# Altium schematic sheet Sheet2.SchDoc
size A4; SheetNumber: 2; SheetTotal: 3
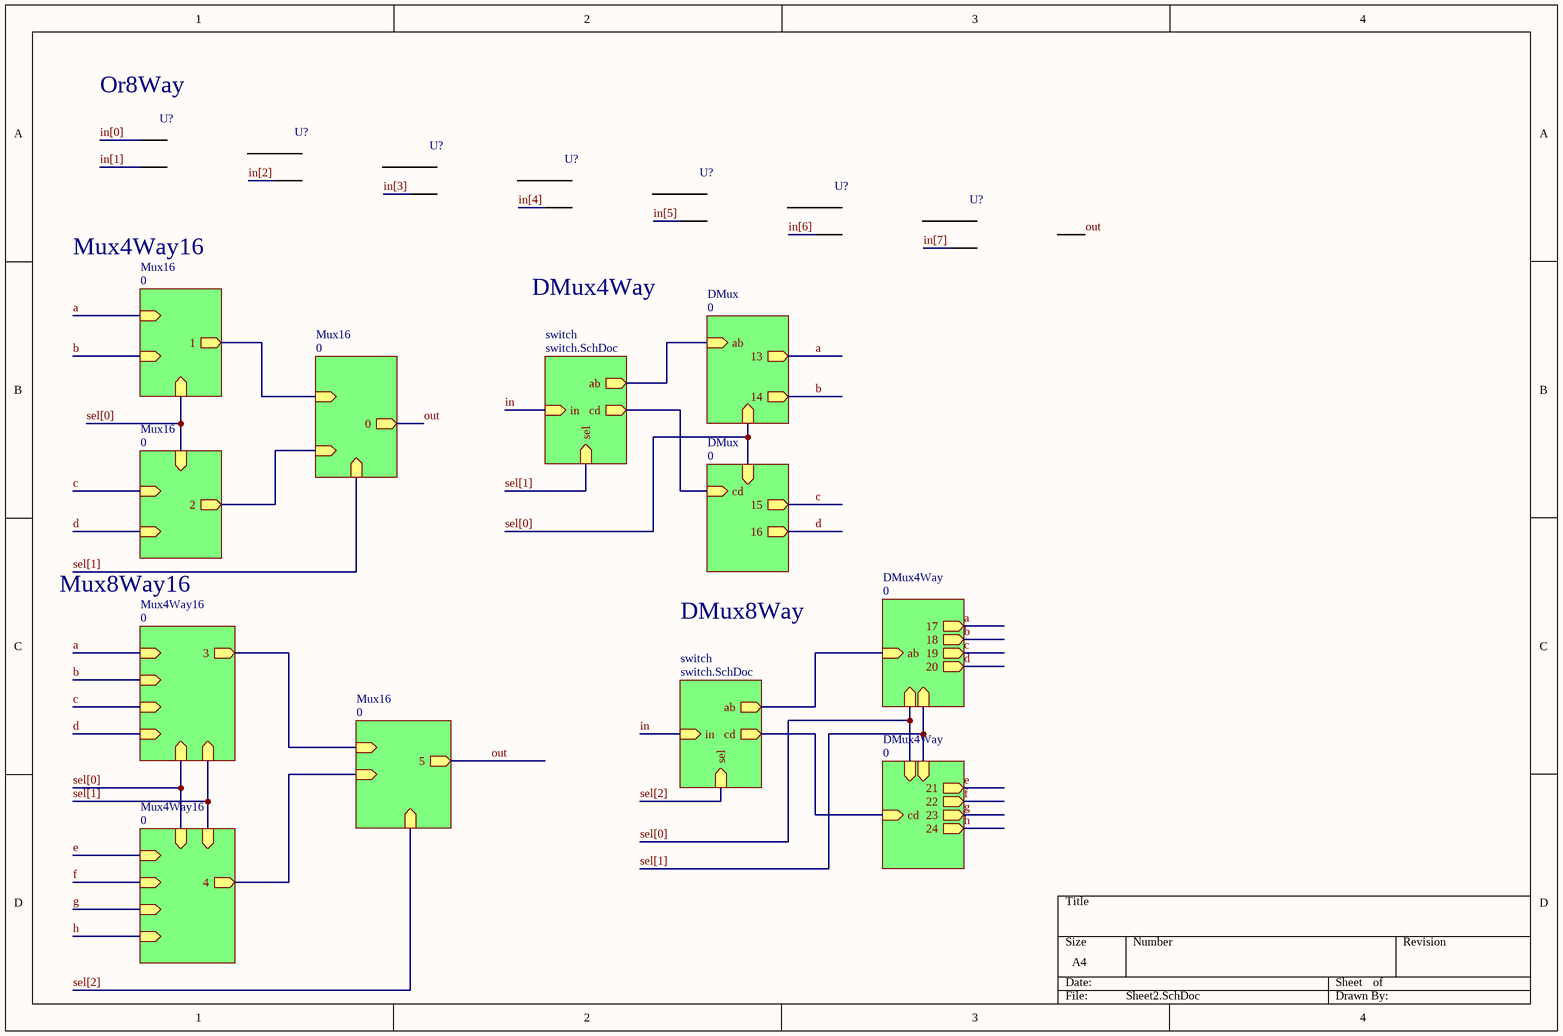
[diagram p0: Sheet2.SchDoc]

## Parts
(Parts that share a designator on the sheet are numbered #1, #2 ... from top to bottom, then left to right.)
U?#1  Digital OR Gate  (value not drawn)
U?#2  Digital OR Gate  (value not drawn)
U?#3  Digital OR Gate  (value not drawn)
U?#4  Digital OR Gate  (value not drawn)
U?#5  Digital OR Gate  (value not drawn)
U?#6  Digital OR Gate  (value not drawn)
U?#7  Digital OR Gate  (value not drawn)

## Sub-sheets
DMux = 0: ab (in),  (in), 13 (out), 14 (out)
DMux = 0: cd (in),  (in), 15 (out), 16 (out)
DMux4Way = 0: ab (in),  (in),  (in), 17 (out), 18 (out), 19 (out), 20 (out)
DMux4Way = 0: cd (in),  (in),  (in), 21 (out), 22 (out), 23 (out), 24 (out)
Mux4Way16 = 0:  (in),  (in),  (in),  (in),  (in),  (in), 3 (out)
Mux4Way16 = 0:  (in),  (in),  (in),  (in),  (in),  (in), 4 (out)
Mux16 = 0:  (in),  (in),  (in), 1 (out)
Mux16 = 0:  (in),  (in),  (in), 2 (out)
Mux16 = 0:  (in),  (in),  (in), 0 (out)
Mux16 = 0:  (in),  (in),  (in), 5 (out)
switch = switch.SchDoc: in (in), sel (in), ab (out), cd (out)
switch = switch.SchDoc: in (in), sel (in), ab (out), cd (out)

## Nets
a: sheet Mux16/, sheet Mux4Way16/, sheet DMux/13, sheet DMux4Way/17
b: sheet Mux16/, sheet Mux4Way16/, sheet DMux/14, sheet DMux4Way/18
c: sheet Mux16/, sheet Mux4Way16/, sheet DMux/15, sheet DMux4Way/19
d: sheet Mux16/, sheet Mux4Way16/, sheet DMux/16, sheet DMux4Way/20
e: sheet Mux4Way16/, sheet DMux4Way/21
f: sheet Mux4Way16/, sheet DMux4Way/22
g: sheet Mux4Way16/, sheet DMux4Way/23
h: sheet Mux4Way16/, sheet DMux4Way/24
in: sheet switch/in, sheet switch/in
in[0]: U?#1.1
in[1]: U?#1.2
in[2]: U?#2.2
in[3]: U?#3.2
in[4]: U?#4.2
in[5]: U?#5.2
in[6]: U?#6.2
in[7]: U?#7.2
out: U?#7.3 ; sheet Mux16/0, sheet Mux16/5
sel[0]: sheet Mux16/, sheet Mux16/, sheet Mux4Way16/, sheet Mux4Way16/, sheet DMux/, sheet DMux/, sheet DMux4Way/, sheet DMux4Way/
sel[1]: sheet Mux16/, sheet Mux4Way16/, sheet Mux4Way16/, sheet switch/sel, sheet DMux4Way/, sheet DMux4Way/
sel[2]: sheet Mux16/, sheet switch/sel
NetU?#1_3: U?#1.3 U?#2.1
NetU?#2_3: U?#2.3 U?#3.1
NetU?#3_3: U?#3.3 U?#4.1
NetU?#4_3: U?#4.3 U?#5.1
NetU?#5_3: U?#5.3 U?#6.1
NetU?#6_3: U?#6.3 U?#7.1
(unnamed): sheet Mux16/1, sheet Mux16/
(unnamed): sheet Mux16/2, sheet Mux16/
(unnamed): sheet Mux4Way16/3, sheet Mux16/
(unnamed): sheet Mux4Way16/4, sheet Mux16/
(unnamed): sheet switch/ab, sheet DMux/ab
(unnamed): sheet switch/cd, sheet DMux/cd
(unnamed): sheet switch/ab, sheet DMux4Way/ab
(unnamed): sheet switch/cd, sheet DMux4Way/cd

## Notes on the sheet
- (near U?#1) Or8Way
- Mux4Way16
- DMux4Way
- Mux8Way16
- DMux8Way

## Library data of the parts
U?#1-U?#7 = Digital OR: rise_delay_inst: 1n; input_load_inst: 1p; SimulationGenericComponent: True; fall_delay_inst: 1n